# EAGLE design smd-reflow-1 (EAGLE 7.2.0)
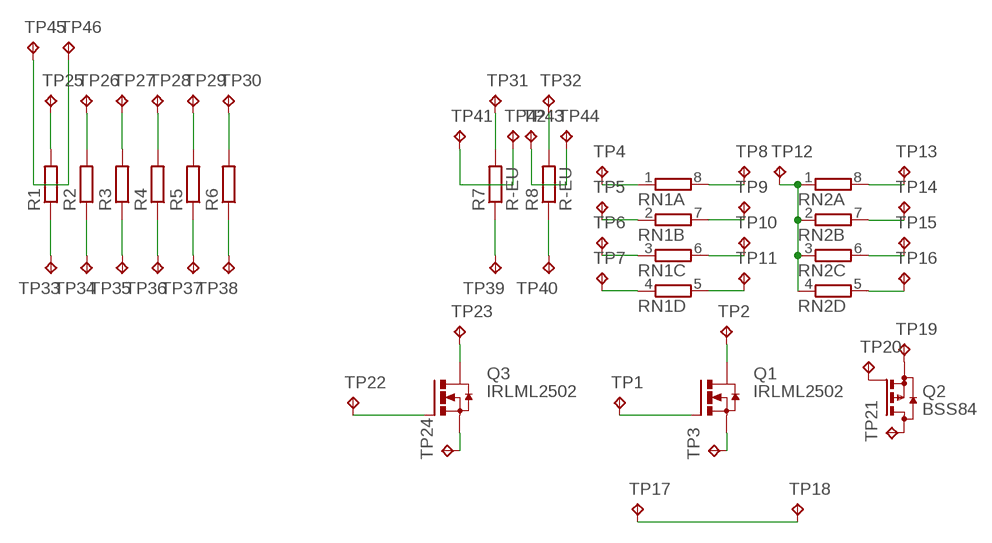
[diagram p0: schematic, sheet 1]

## Parts
Q1  IRLML2502  [MICRO3]
Q2  BSS84  [SOT23]
Q3  IRLML2502  [MICRO3]
R1  R-EU_R0603  [R0603]
R2  R-EU_R0603  [R0603]
R3  R-EU_R0805  [R0805]
R4  R-EU_R0805  [R0805]
R5  R-EU_R0805W  [R0805W]
R6  R-EU_R0805W  [R0805W]
R7  R-EU  [R0805H]
R8  R-EU  [R0805H]
RN1  4R-NEXB38V  [EXB38V]
RN2  4R-NEXB38V  [EXB38V]
TP1  TPB1,27  [B1,27]
TP2  TPB1,27  [B1,27]
TP3  TPB1,27  [B1,27]
TP4  TPB1,27  [B1,27]
TP5  TPB1,27  [B1,27]
TP6  TPB1,27  [B1,27]
TP7  TPB1,27  [B1,27]
TP8  TPB1,27  [B1,27]
TP9  TPB1,27  [B1,27]
TP10  TPB1,27  [B1,27]
TP11  TPB1,27  [B1,27]
TP12  TPB1,27  [B1,27]
TP13  TPB1,27  [B1,27]
TP14  TPB1,27  [B1,27]
TP15  TPB1,27  [B1,27]
TP16  TPB1,27  [B1,27]
TP17  TPB1,27  [B1,27]
TP18  TPB1,27  [B1,27]
TP19  TPB1,27  [B1,27]
TP20  TPB1,27  [B1,27]
TP21  TPB1,27  [B1,27]
TP22  TPB1,27  [B1,27]
TP23  TPB1,27  [B1,27]
TP24  TPB1,27  [B1,27]
TP25  TPB1,27  [B1,27]
TP26  TPB1,27  [B1,27]
TP27  TPB1,27  [B1,27]
TP28  TPB1,27  [B1,27]
TP29  TPB1,27  [B1,27]
TP30  TPB1,27  [B1,27]
TP31  TPB1,27  [B1,27]
TP32  TPB1,27  [B1,27]
TP33  TPB1,27  [B1,27]
TP34  TPB1,27  [B1,27]
TP35  TPB1,27  [B1,27]
TP36  TPB1,27  [B1,27]
TP37  TPB1,27  [B1,27]
TP38  TPB1,27  [B1,27]
TP39  TPB1,27  [B1,27]
TP40  TPB1,27  [B1,27]
TP41  TPB1,27  [B1,27]
TP42  TPB1,27  [B1,27]
TP43  TPB1,27  [B1,27]
TP44  TPB1,27  [B1,27]
TP45  TPB1,27  [B1,27]
TP46  TPB1,27  [B1,27]

## Nets
N$1: RN1.1 TP4.TP
N$2: RN1.2 TP5.TP
N$3: RN1.3 TP6.TP
N$4: RN1.4 TP7.TP
N$5: RN1.8 TP8.TP
N$6: RN1.7 TP9.TP
N$7: RN1.6 TP10.TP
N$8: RN1.5 TP11.TP
N$9: RN2.1 RN2.2 RN2.3 RN2.4 TP12.TP
N$10: RN2.8 TP13.TP
N$11: RN2.7 TP14.TP
N$12: RN2.6 TP15.TP
N$13: RN2.5 TP16.TP
N$14: Q1.3(D) TP2.TP
N$15: Q1.1(G) TP1.TP
N$16: Q1.2(S) TP3.TP
N$17: TP17.TP TP18.TP
N$18: Q2.2(S) TP19.TP
N$19: Q2.1(G) TP20.TP
N$20: Q2.3(D) TP21.TP
N$21: Q3.3(D) TP23.TP
N$22: Q3.1(G) TP22.TP
N$23: Q3.2(S) TP24.TP
N$24: R1.2 TP25.TP
N$25: R2.2 TP26.TP
N$26: R3.2 TP27.TP
N$27: R4.2 TP28.TP
N$28: R6.2 TP30.TP
N$29: R5.2 TP29.TP
N$30: R7.2 TP31.TP
N$31: R8.2 TP32.TP
N$32: R1.1 TP33.TP
N$33: R2.1 TP34.TP
N$34: R3.1 TP35.TP
N$35: R4.1 TP36.TP
N$36: R5.1 TP37.TP
N$37: R6.1 TP38.TP
N$38: R7.1 TP39.TP
N$39: R8.1 TP40.TP
N$40: TP41.TP TP42.TP
N$41: TP43.TP TP44.TP
N$42: TP45.TP TP46.TP

## Library data of the parts
Q1 Q3 = trainlib:IRLML2502: HEXFET Power MosFet 20V, 4.5A, 0.045R SOT-23 package Source: http://www.irf.com/
Q2 = transistor-small-signal:BSS84: P-CHANNEL MOS FET
R1-R6 = resistor:R-EU_: RESISTOR, European symbol
R7 R8 = trainlib:R-EU
RN1 RN2 = resistor-dil:4R-N: Array Chip Resistor Source: RS Component / Phycomp; OC_FARNELL: unknown; OC_NEWARK: unknown
TP1-TP46 = testpad:TP: Test pad

## Net classes
1 pwr: width 0.254 mm
2 hipwr: width 0.5 mm

## Board
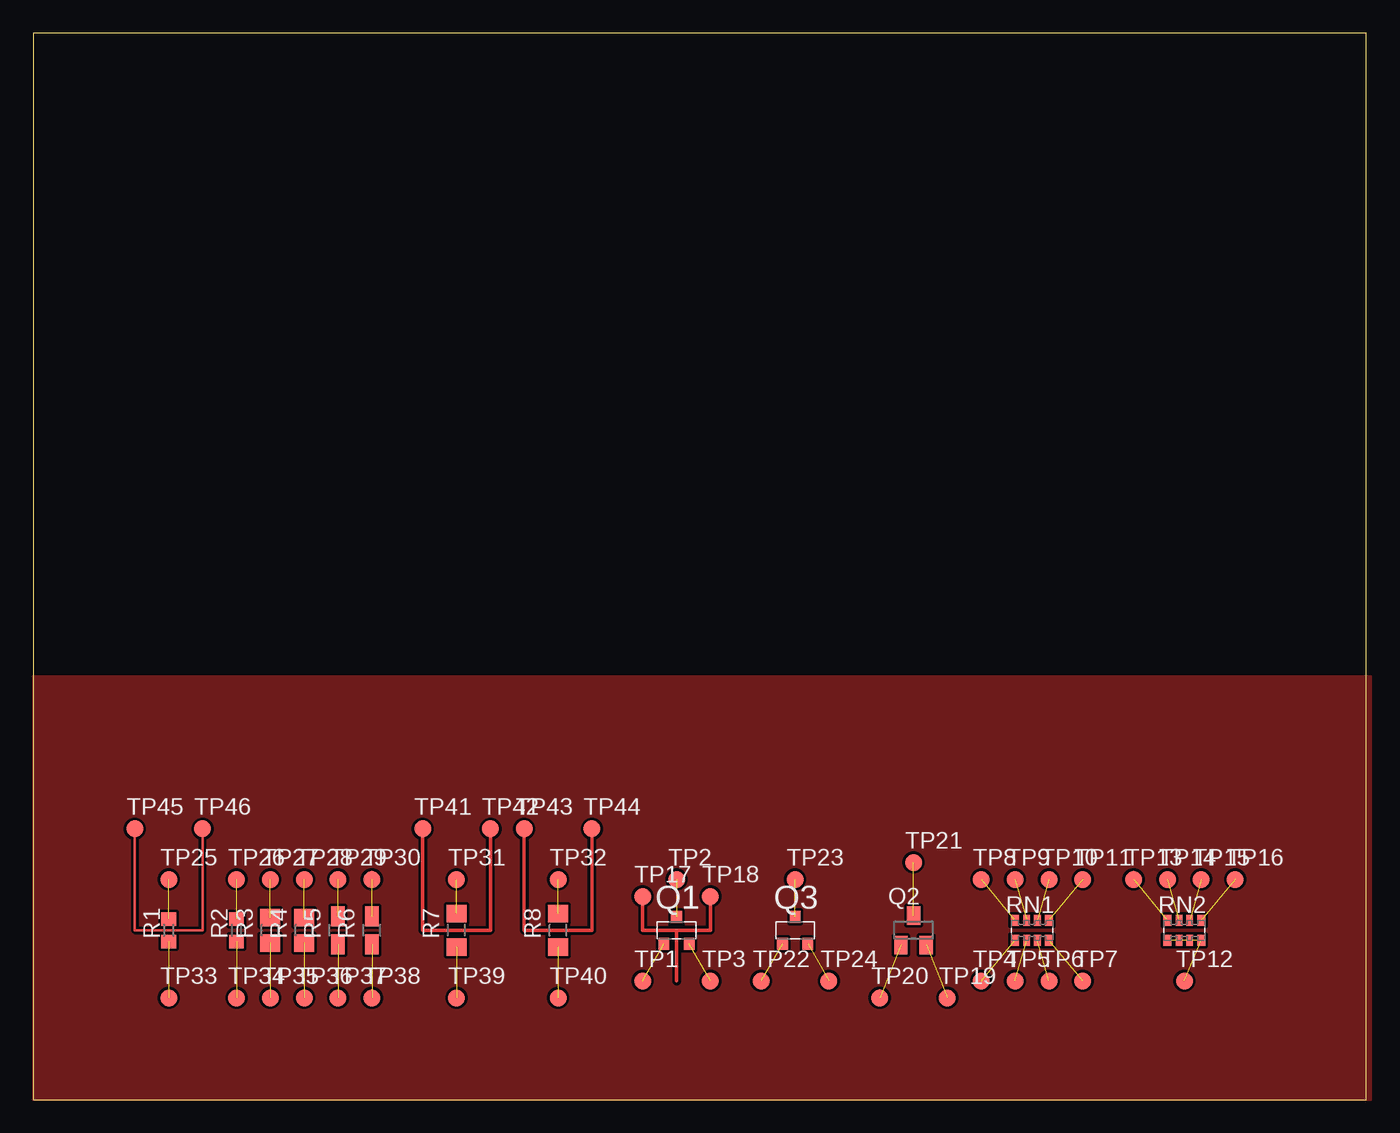
[diagram p1: board, top side]

Size 100 x 80 mm. Coordinates in mm from the lower left corner, seen from the top.
Outline: 0,0 100,0 100,80 0,80 0,0
Copper layers (1*16): Top 0.035mm / dielectric 1.5mm / Bottom 0.035mm
Design rules "default *": minimum track width 10mil, minimum drill 24mil, track to track 8mil, track to pad 8mil, pad to pad 8mil, via to via 8mil, smd to smd 8mil, copper to edge 0mil, drill to drill 8mil, minimum pad ring 10mil, minimum via ring 8mil, stop-mask expansion 4mil, vias tented up to drill 0mil, thermal gap 10mil

### Footprints (pad centres in the part's own frame; a part is rotated, then mirrored left to right if it is on the bottom)
MICRO3 = smd 0.8 x 0.9: 1 -0.95,-1; 2 0.95,-1; 3 0,1
SOT23 = smd 1 x 1.4: 1 -0.95,-1.1; 2 0.95,-1.1; 3 0,1.1
R0603 = smd 1 x 1.1: 1 -0.85,0; 2 0.85,0
R0805 = smd 1.3 x 1.5: 1 -0.95,0; 2 0.95,0
R0805W = smd 1.5 x 1: 1 -1.052,0; 2 1.052,0
R0805H = smd 1.3 x 1.5: 1 -1.255,0; 2 1.255,0
EXB38V = smd 0.6 x 0.8: 1 -1.275,-0.75; 4 1.275,-0.75; 5 1.275,0.75; 8 -1.275,0.75 | smd 0.5 x 0.8: 2 -0.4,-0.75; 3 0.4,-0.75; 6 0.4,0.75; 7 -0.4,0.75
B1,27 = smd 1.27 x 1.27: TP 0,0

### Placement (x,y rotation side)
Q1  48.26,12.7 0 top
Q2  66.04,12.7 0 top
Q3  57.15,12.7 0 top
R1  10.16,12.7 90 top
R2  15.24,12.7 90 top
R3  17.78,12.7 90 top
R4  20.32,12.7 90 top
R5  22.86,12.7 90 top
R6  25.4,12.7 90 top
R7  31.75,12.7 90 top
R8  39.37,12.7 90 top
RN1  74.93,12.7 0 top
RN2  86.36,12.7 0 top
TP1  45.72,8.89 0 top
TP2  48.26,16.51 0 top
TP3  50.8,8.89 0 top
TP4  71.12,8.89 0 top
TP5  73.66,8.89 0 top
TP6  76.2,8.89 0 top
TP7  78.74,8.89 0 top
TP8  71.12,16.51 0 top
TP9  73.66,16.51 0 top
TP10  76.2,16.51 0 top
TP11  78.74,16.51 0 top
TP12  86.36,8.89 0 top
TP13  82.55,16.51 0 top
TP14  85.09,16.51 0 top
TP15  87.63,16.51 0 top
TP16  90.17,16.51 0 top
TP17  45.72,15.24 0 top
TP18  50.8,15.24 0 top
TP19  68.58,7.62 0 top
TP20  63.5,7.62 0 top
TP21  66.04,17.78 0 top
TP22  54.61,8.89 0 top
TP23  57.15,16.51 0 top
TP24  59.69,8.89 0 top
TP25  10.16,16.51 0 top
TP26  15.24,16.51 0 top
TP27  17.78,16.51 0 top
TP28  20.32,16.51 0 top
TP29  22.86,16.51 0 top
TP30  25.4,16.51 0 top
TP31  31.75,16.51 0 top
TP32  39.37,16.51 0 top
TP33  10.16,7.62 0 top
TP34  15.24,7.62 0 top
TP35  17.78,7.62 0 top
TP36  20.32,7.62 0 top
TP37  22.86,7.62 0 top
TP38  25.4,7.62 0 top
TP39  31.75,7.62 0 top
TP40  39.37,7.62 0 top
TP41  29.21,20.32 0 top
TP42  34.29,20.32 0 top
TP43  36.83,20.32 0 top
TP44  41.91,20.32 0 top
TP45  7.62,20.32 0 top
TP46  12.7,20.32 0 top

### Tracks (layer width: path | path; a pad name or v marks a point on that pad's centre or on a via)
N$1  (1 unrouted)
N$2  (1 unrouted)
N$3  (1 unrouted)
N$4  (1 unrouted)
N$5  (1 unrouted)
N$6  (1 unrouted)
N$7  (1 unrouted)
N$8  (1 unrouted)
N$9  (4 unrouted)
N$10  (1 unrouted)
N$11  (1 unrouted)
N$12  (1 unrouted)
N$13  (1 unrouted)
N$14  (1 unrouted)
N$15  (1 unrouted)
N$16  (1 unrouted)
N$17
  Top 0.254: TP17.TP 45.72,12.7 48.26,12.7 | TP18.TP 50.8,12.7 48.26,12.7 | 48.26,12.7 48.26,8.89
N$18  (1 unrouted)
N$19  (1 unrouted)
N$20  (1 unrouted)
N$21  (1 unrouted)
N$22  (1 unrouted)
N$23  (1 unrouted)
N$24  (1 unrouted)
N$25  (1 unrouted)
N$26  (1 unrouted)
N$27  (1 unrouted)
N$28  (1 unrouted)
N$29  (1 unrouted)
N$30  (1 unrouted)
N$31  (1 unrouted)
N$32  (1 unrouted)
N$33  (1 unrouted)
N$34  (1 unrouted)
N$35  (1 unrouted)
N$36  (1 unrouted)
N$37  (1 unrouted)
N$38  (1 unrouted)
N$39  (1 unrouted)
N$40
  Top 0.254: TP41.TP 29.21,12.7 34.29,12.7 TP42.TP
N$41
  Top 0.254: TP43.TP 36.83,12.7 41.91,12.7 TP44.TP
N$42
  Top 0.203: TP45.TP 7.62,12.7 12.7,12.7 TP46.TP
N$43
  pour Top: 0,31.75 100.33,31.75 100.33,0 0,0